# EAGLE schematic APU_PayloadBoard_Schematic (EAGLE 9.7.0)

## Sheet 1 of 2
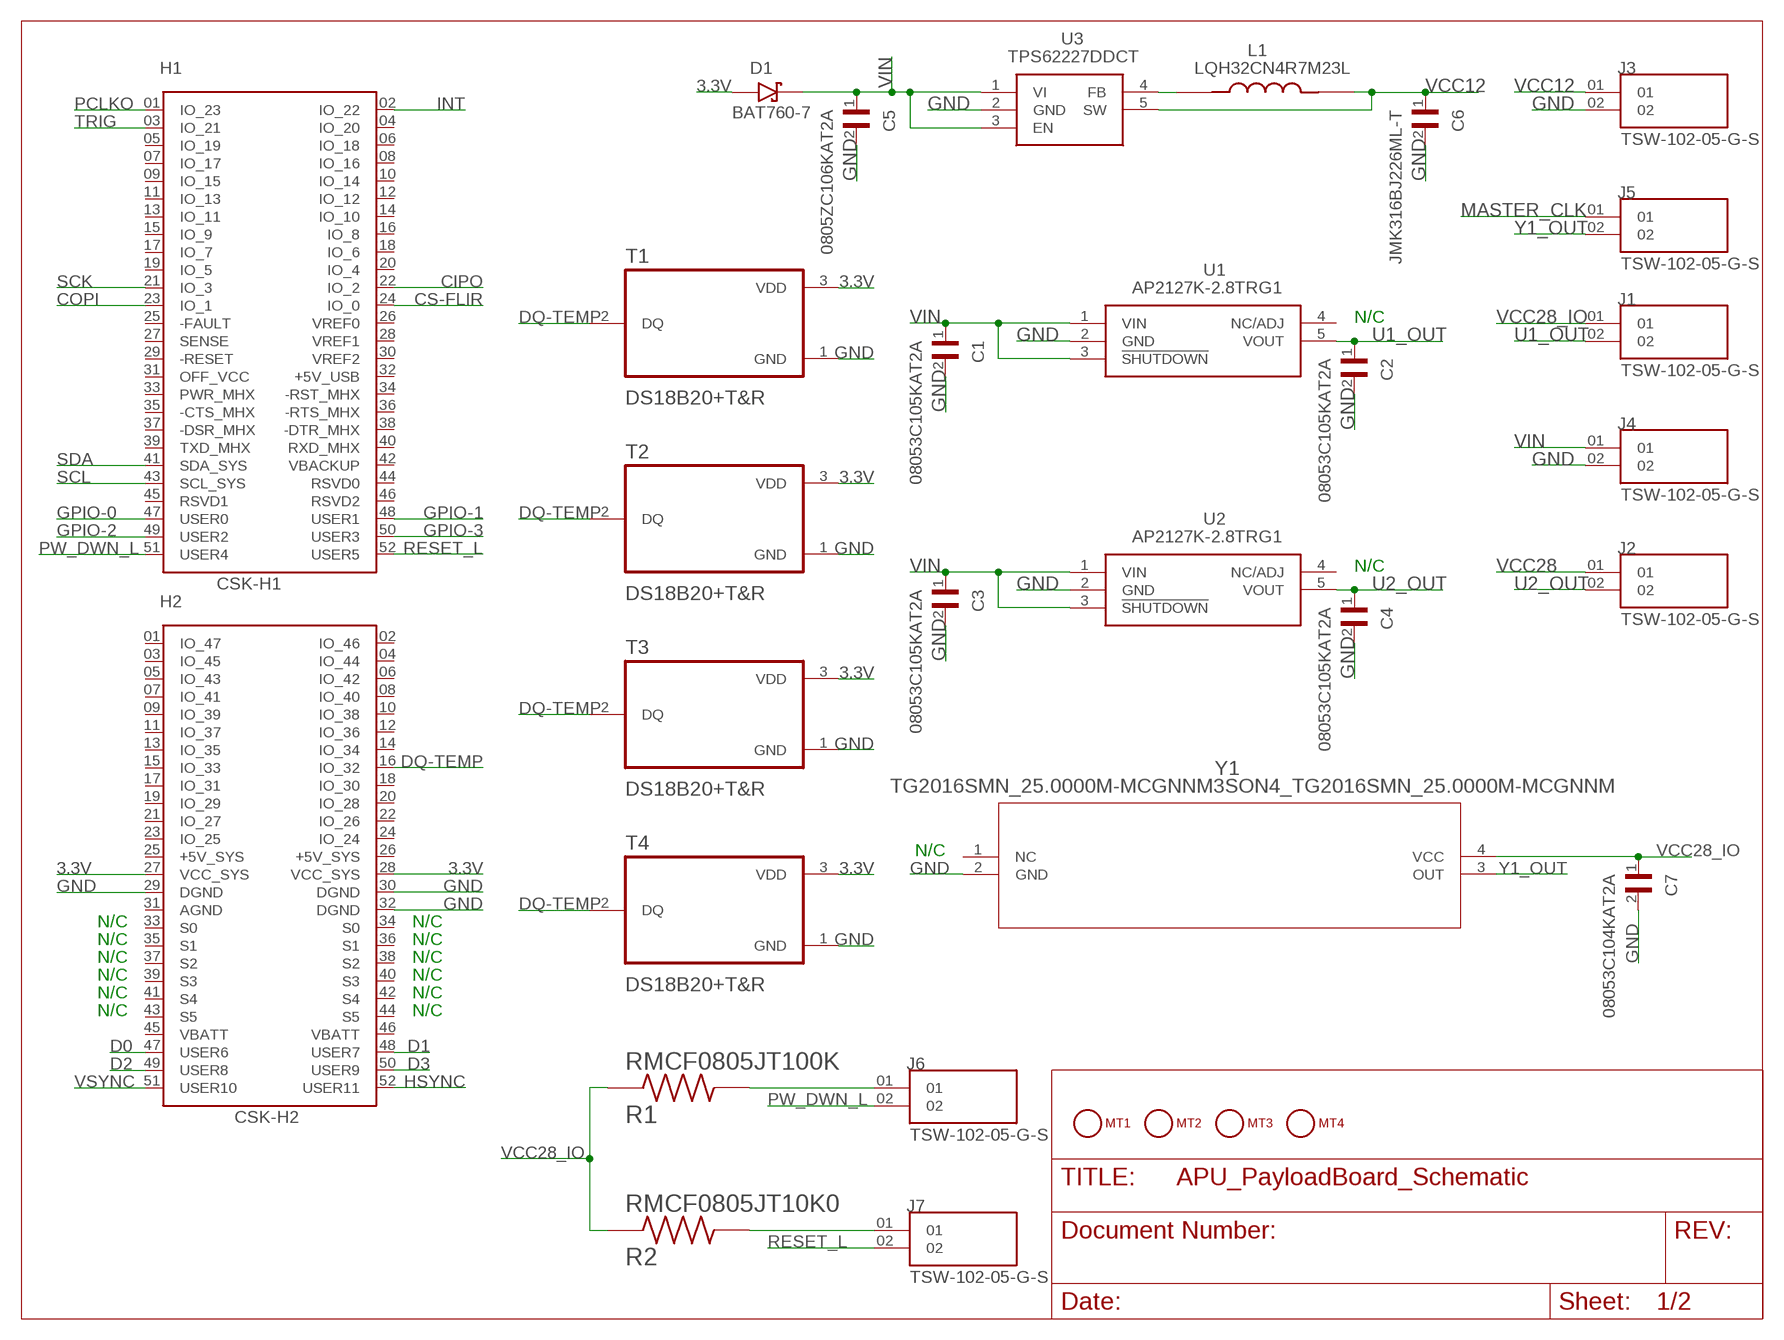
[diagram p0: schematic, sheet 1]

### Parts
C1  08053C105KAT2A  [CAPC2012X94N]
C2  08053C105KAT2A  [CAPC2012X94N]
C3  08053C105KAT2A  [CAPC2012X94N]
C4  08053C105KAT2A  [CAPC2012X94N]
C5  0805ZC106KAT2A  [CAPC2012X152N]
C6  JMK316BJ226ML-T  [CAPC3216X180N]
C7  08053C104KAT2A  [CAPC2012X94N]
D1  BAT760-7  [SOD2513X120N]
H1  CSK-H1  [SAMTEC_ESQ-126-37-G-D--NUMBERED-FOR-CUBESAT-BUS]
H2  CSK-H2  [SAMTEC_ESQ-126-37-G-D--NUMBERED-FOR-CUBESAT-BUS]
J1  TSW-102-05-G-S  [SAMTEC_TSW-102-05-G-S]
J2  TSW-102-05-G-S  [SAMTEC_TSW-102-05-G-S]
J3  TSW-102-05-G-S  [SAMTEC_TSW-102-05-G-S]
J4  TSW-102-05-G-S  [SAMTEC_TSW-102-05-G-S]
J5  TSW-102-05-G-S  [SAMTEC_TSW-102-05-G-S]
J6  TSW-102-05-G-S  [SAMTEC_TSW-102-05-G-S]
J7  TSW-102-05-G-S  [SAMTEC_TSW-102-05-G-S]
L1  LQH32CN4R7M23L  [IND_LQH32CN4R7M23L]
MT1  MOUNTING_HOLE-125_250_ROUND  [MT_125_250]
MT2  MOUNTING_HOLE-125_250_ROUND  [MT_125_250]
MT3  MOUNTING_HOLE-125_250_ROUND  [MT_125_250]
MT4  MOUNTING_HOLE-125_250_ROUND  [MT_125_250]
R1  RMCF0805JT100K  [RESC2012X65N]
R2  RMCF0805JT10K0  [RESC2012X65N]
T1  DS18B20+T&R  [DS18B20+T&R]
T2  DS18B20+T&R  [DS18B20+T&R]
T3  DS18B20+T&R  [DS18B20+T&R]
T4  DS18B20+T&R  [DS18B20+T&R]
U1  AP2127K-2.8TRG1  [SOT95P282X145-5N]
U2  AP2127K-2.8TRG1  [SOT95P282X145-5N]
U3  TPS62227DDCT  [SOT95P280X110-5N]
Y1  TG2016SMN_25.0000M-MCGNNM3SON4_TG2016SMN_25.0000M-MCGNNM  [SON4_TG2016SMN_25.0000M-MCGNNM]

### Nets
3.3V: D1.A H2.27(VCC_SYS) H2.28(VCC_SYS) T1.3(VDD) T2.3(VDD) T3.3(VDD) T4.3(VDD) ; also sheet 2
CIPO: H1.22(IO_2) ; also sheet 2
COPI: H1.23(IO_1) ; also sheet 2
CS-FLIR: H1.24(IO_0) ; also sheet 2
D0: H2.47(USER6) ; also sheet 2
D1: H2.48(USER7) ; also sheet 2
D2: H2.49(USER8) ; also sheet 2
D3: H2.50(USER9) ; also sheet 2
DQ-TEMP: H2.16(IO_32) T1.2(DQ) T2.2(DQ) T3.2(DQ) T4.2(DQ)
GND: C1.2 C2.2 C3.2 C4.2 C5.2 C6.2 C7.2 H2.29(DGND) H2.30(DGND) H2.32(DGND) J3.02 J4.02 T1.1(GND) T2.1(GND) T3.1(GND) T4.1(GND) U1.2(GND) U2.2(GND) U3.2(GND) Y1.2(GND) ; also sheet 2
GPIO-0: H1.47(USER0) ; also sheet 2
GPIO-1: H1.48(USER1) ; also sheet 2
GPIO-2: H1.49(USER2) ; also sheet 2
GPIO-3: H1.50(USER3) ; also sheet 2
HSYNC: H2.52(USER11) ; also sheet 2
INT: H1.02(IO_22) ; also sheet 2
MASTER_CLK: J5.01 ; also sheet 2
N$1: L1.1 U3.4(FB)
N$2: J6.01 R1.2
N$3: J7.01 R2.2
PCLKO: H1.01(IO_23) ; also sheet 2
PW_DWN_L: H1.51(USER4) J6.02 ; also sheet 2
RESET_L: H1.52(USER5) J7.02 ; also sheet 2
SCK: H1.21(IO_3) ; also sheet 2
SCL: H1.43(SCL_SYS) ; also sheet 2
SDA: H1.41(SDA_SYS) ; also sheet 2
TRIG: H1.03(IO_21) ; also sheet 2
U1_OUT: C2.1 J1.02 U1.5(VOUT)
U2_OUT: C4.1 J2.02 U2.5(VOUT)
VCC12: C6.1 J3.01 L1.2 U3.5(SW) ; also sheet 2
VCC28: J2.01 ; also sheet 2
VCC28_IO: C7.1 J1.01 R1.1 R2.1 Y1.4(VCC) ; also sheet 2
VIN: C1.1 C3.1 C5.1 D1.C(K) J4.01 U1.1(VIN) U1.3(!SHUTDOWN) U2.1(VIN) U2.3(!SHUTDOWN) U3.1(VI) U3.3(EN)
VSYNC: H2.51(USER10) ; also sheet 2
Y1_OUT: J5.02 Y1.3(OUT)
Unconnected: H1.04(IO_20) H1.05(IO_19) H1.06(IO_18) H1.07(IO_17) H1.08(IO_16) H1.09(IO_15) H1.10(IO_14) H1.11(IO_13) H1.12(IO_12) H1.13(IO_11) H1.14(IO_10) H1.15(IO_9) H1.16(IO_8) H1.17(IO_7) H1.18(IO_6) H1.19(IO_5) H1.20(IO_4) H1.25(-FAULT) H1.26(VREF0) H1.27(SENSE) H1.28(VREF1) H1.29(-RESET) H1.30(VREF2) H1.31(OFF_VCC) H1.32(+5V_USB) H1.33(PWR_MHX) H1.34(-RST_MHX) H1.35(-CTS_MHX) H1.36(-RTS_MHX) H1.37(-DSR_MHX) H1.38(-DTR_MHX) H1.39(TXD_MHX) H1.40(RXD_MHX) H1.42(VBACKUP) H1.44(RSVD0) H1.45(RSVD1) H1.46(RSVD2) H2.01(IO_47) H2.02(IO_46) H2.03(IO_45) H2.04(IO_44) H2.05(IO_43) H2.06(IO_42) H2.07(IO_41) H2.08(IO_40) H2.09(IO_39) H2.10(IO_38) H2.11(IO_37) H2.12(IO_36) H2.13(IO_35) H2.14(IO_34) H2.15(IO_33) H2.17(IO_31) H2.18(IO_30) H2.19(IO_29) H2.20(IO_28) H2.21(IO_27) H2.22(IO_26) H2.23(IO_25) H2.24(IO_24) H2.25(+5V_SYS) H2.26(+5V_SYS) H2.31(AGND) H2.33(S0) H2.34(S0) H2.35(S1) H2.36(S1) H2.37(S2) H2.38(S2) H2.39(S3) H2.40(S3) H2.41(S4) H2.42(S4) H2.43(S5) H2.44(S5) H2.45(VBATT) H2.46(VBATT) MT1.1 MT2.1 MT3.1 MT4.1 U1.4(NC/ADJ) U2.4(NC/ADJ) Y1.1(NC)

### Notes on the sheet
- N/C
- N/C
- N/C
- N/C | N/C
- N/C | N/C
- N/C | N/C
- N/C | N/C
- N/C | N/C
- N/C | N/C

## Sheet 2 of 2
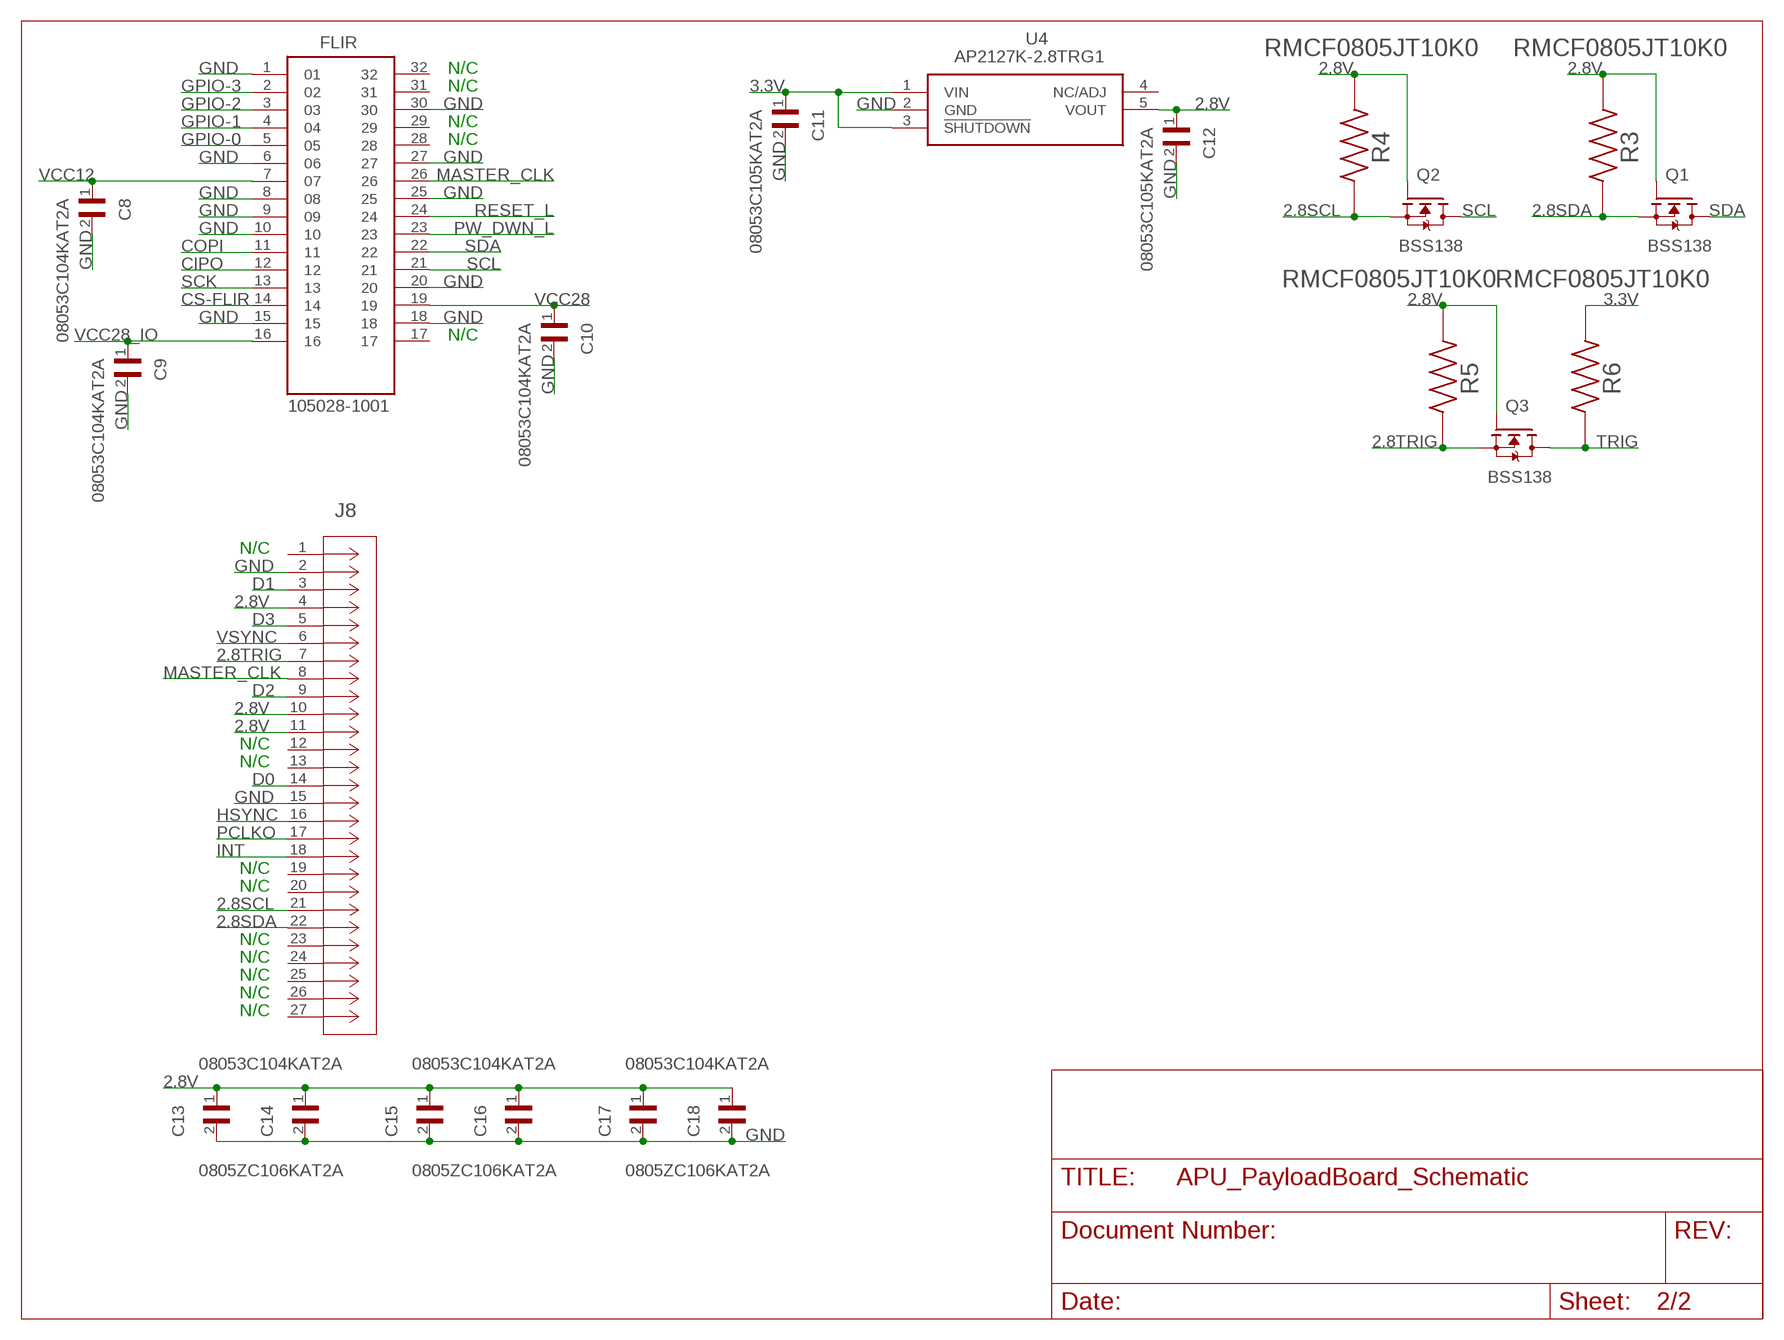
[diagram p1: schematic, sheet 2]

### Parts
C8  08053C104KAT2A  [CAPC2012X94N]
C9  08053C104KAT2A  [CAPC2012X94N]
C10  08053C104KAT2A  [CAPC2012X94N]
C11  08053C105KAT2A  [CAPC2012X94N]
C12  08053C105KAT2A  [CAPC2012X94N]
C13  08053C104KAT2A  [CAPC2012X94N]
C14  0805ZC106KAT2A  [CAPC2012X152N]
C15  08053C104KAT2A  [CAPC2012X94N]
C16  0805ZC106KAT2A  [CAPC2012X152N]
C17  08053C104KAT2A  [CAPC2012X94N]
C18  0805ZC106KAT2A  [CAPC2012X152N]
FLIR  105028-1001  [MOLEX_105028-1001]
J8  SFV25R-1STE1LFCON25_1X25_DR_SFV_JAE  [CON25_1X25_DR_SFV_JAE]
Q1  BSS138  [SOT95P240X111-3N]
Q2  BSS138  [SOT95P240X111-3N]
Q3  BSS138  [SOT95P240X111-3N]
R3  RMCF0805JT10K0  [RESC2012X65N]
R4  RMCF0805JT10K0  [RESC2012X65N]
R5  RMCF0805JT10K0  [RESC2012X65N]
R6  RMCF0805JT10K0  [RESC2012X65N]
U4  AP2127K-2.8TRG1  [SOT95P282X145-5N]

### Nets
2.8SCL: J8.21 Q2.2(S) R4.1
2.8SDA: J8.22 Q1.2(S) R3.1
2.8TRIG: J8.7 Q3.2(S) R5.1
2.8V: C12.1 C13.1 C14.1 C15.1 C16.1 C17.1 C18.1 J8.4 J8.10 J8.11 Q1.1(G) Q2.1(G) Q3.1(G) R3.2 R4.2 R5.2 U4.5(VOUT)
3.3V: C11.1 R6.2 U4.1(VIN) U4.3(!SHUTDOWN) ; also sheet 1
CIPO: FLIR.12 ; also sheet 1
COPI: FLIR.11 ; also sheet 1
CS-FLIR: FLIR.14 ; also sheet 1
D0: J8.14 ; also sheet 1
D1: J8.3 ; also sheet 1
D2: J8.9 ; also sheet 1
D3: J8.5 ; also sheet 1
GND: C8.2 C9.2 C10.2 C11.2 C12.2 C13.2 C14.2 C15.2 C16.2 C17.2 C18.2 FLIR.1 FLIR.6 FLIR.8 FLIR.9 FLIR.10 FLIR.15 FLIR.18 FLIR.20 FLIR.25 FLIR.27 FLIR.30 J8.2 J8.15 U4.2(GND) ; also sheet 1
GPIO-0: FLIR.5 ; also sheet 1
GPIO-1: FLIR.4 ; also sheet 1
GPIO-2: FLIR.3 ; also sheet 1
GPIO-3: FLIR.2 ; also sheet 1
HSYNC: J8.16 ; also sheet 1
INT: J8.18 ; also sheet 1
MASTER_CLK: FLIR.26 J8.8 ; also sheet 1
PCLKO: J8.17 ; also sheet 1
PW_DWN_L: FLIR.23 ; also sheet 1
RESET_L: FLIR.24 ; also sheet 1
SCK: FLIR.13 ; also sheet 1
SCL: FLIR.21 Q2.3(D) ; also sheet 1
SDA: FLIR.22 Q1.3(D) ; also sheet 1
TRIG: Q3.3(D) R6.1 ; also sheet 1
VCC12: C8.1 FLIR.7 ; also sheet 1
VCC28: C10.1 FLIR.19 ; also sheet 1
VCC28_IO: C9.1 FLIR.16 ; also sheet 1
VSYNC: J8.6 ; also sheet 1
Unconnected: FLIR.17 FLIR.28 FLIR.29 FLIR.31 FLIR.32 J8.1 J8.12 J8.13 J8.19 J8.20 J8.23 J8.24 J8.25 J8.26 J8.27 U4.4(NC/ADJ)

### Notes on the sheet
- N/C
- N/C
- N/C
- N/C
- N/C
- N/C
- N/C
- N/C
- N/C
- N/C
- N/C
- N/C
- N/C
- N/C
- N/C

## Library data of the parts
C1-C4 C11 C12 = apu-csk-payloadboard:08053C105KAT2A: Cap Ceramic 1uF 25V X7R 10% SMD 0805 125°C Embossed T/R Check availability <https://pricing.snapeda.com/parts/08053C105KAT2A/AVX/view-part?ref=eda>; AVAILABILITY: In Stock; DESCRIPTION: 1 µF ±10% 25V Ceramic Capacitor X7R 0805 (2012 Metric); MF: AVX; MP: 08053C105KAT2A; PACKAGE: 2012 AVX; PRICE: None; PURCHASE-URL: https://pricing.snapeda.com/search/part/08053C105KAT2A/?ref=eda
C5 C14 C16 C18 = apu-csk-payloadboard:0805ZC106KAT2A: 0805 10 uF 10V ±10% Tolerance X7R SMT Multilayer Ceramic Capacitor Check availability <https://pricing.snapeda.com/parts/0805ZC106KAT2A/AVX/view-part?ref=eda>; AVAILABILITY: In Stock; DESCRIPTION: 10 µF ±10% 10V Ceramic Capacitor X7R 0805 (2012 Metric); MF: AVX; MP: 0805ZC106KAT2A; PACKAGE: 2012 AVX; PRICE: None
C6 = apu-csk-payloadboard:JMK316BJ226ML-T: Cap Ceramic 22uF 6.3V X5R 20% Pad SMD 1206 85C T/R Check availability <https://pricing.snapeda.com/parts/JMK316BJ226ML-T/Taiyo%20Yuden/view-part?ref=eda>; AVAILABILITY: In Stock; DESCRIPTION: 22 µF ±20% 6.3V Ceramic Capacitor X5R 1206 (3216 Metric); MF: Taiyo Yuden; MP: JMK316BJ226ML-T; PACKAGE: 3216 Taiyo Yuden; PRICE: None; PURCHASE-URL: https://pricing.snapeda.com/search?q=JMK316BJ226ML-T&ref=eda
C7-C10 C13 C15 C17 = apu-csk-payloadboard:08053C104KAT2A: Cap Ceramic 0.1uF 25V X7R 10% Pad SMD 0805 125 T/R Check availability <https://pricing.snapeda.com/parts/08053C104KAT2A/AVX/view-part?ref=eda>; AVAILABILITY: In Stock; DESCRIPTION: 0.1 µF ±10% 25V Ceramic Capacitor X7R 0805 (2012 Metric); MF: AVX; MP: 08053C104KAT2A; PACKAGE: 2012 AVX; PRICE: None; PURCHASE-URL: https://pricing.snapeda.com/search/part/08053C104KAT2A/?ref=eda
D1 = apu-csk-payloadboard:BAT760-7: Diode Schottky 30V 1A Surface Mount SOD-323 Check availability <https://pricing.snapeda.com/parts/BAT760-7/Diodes%20Inc./view-part?ref=eda>; AVAILABILITY: In Stock; DESCRIPTION: Diode Schottky 30 V 1A Surface Mount SOD-323; MF: Diodes Inc.; MP: BAT760-7; PACKAGE: SOD-323 Diodes Inc.; PRICE: None; PURCHASE-URL: https://pricing.snapeda.com/search?q=BAT760-7&ref=eda
FLIR = apu-csk-payloadboard:105028-1001: 32 (4 x 8) Pos Camera Socket Socket Gold Surface Mount Check availability <https://pricing.snapeda.com/parts/1050281001/Molex/view-part?ref=eda>; AVAILABILITY: In Stock; DESCRIPTION: 32 (4 x 8) Pos Camera Socket Socket Gold Surface Mount; MF: Molex; MP: 1050281001; PACKAGE: None; PRICE: None; PURCHASE-URL: https://pricing.snapeda.com/search?q=1050281001&ref=eda
H1 = apu-csk-payloadboard:CSK-H1
H2 = apu-csk-payloadboard:CSK-H2
J1-J7 = apu-csk-payloadboard:TSW-102-05-G-S: Check availability <https://pricing.snapeda.com/parts/TSW-102-05-G-S/Samtec%20Inc./view-part?ref=eda>; AVAILABILITY: In Stock; DESCRIPTION: TSW - Samtec 2.54mm Pin Header 8.51mm Overall Pin Length (05) - Fast Stock; MF: Samtec Inc.; MP: TSW-102-05-G-S; PACKAGE: None; PRICE: None; PURCHASE-URL: https://pricing.snapeda.com/search/part/TSW-102-05-G-S/?ref=eda
J8 = apu-csk-payloadboard:SFV25R-1STE1LF; COPYRIGHT: Copyright (C) 2023 Ultra Librarian. All rights reserved.; MANUFACTURER_PART_NUMBER: SFV25R-1STE1LF; MFR_NAME: JAE Electronics
L1 = apu-csk-payloadboard:LQH32CN4R7M23L: Wire Wound Ferrite Inductor for Power Lines For Automotive Check availability <https://pricing.snapeda.com/parts/LQH32CN4R7M23L/Murata%20Electronics/view-part?ref=eda>; AVAILABILITY: In Stock; DESCRIPTION: 4.7µH Unshielded Wirewound Inductor 450mA 260mOhm Max Nonstandard; MF: Murata Electronics; MP: LQH32CN4R7M23L; PACKAGE: NONSTANDARD; PRICE: None; PURCHASE-URL: https://pricing.snapeda.com/search?q=LQH32CN4R7M23L&ref=eda
MT1-MT4 = apu-csk-payloadboard:MOUNTING_HOLE
Q1-Q3 = apu-csk-payloadboard:BSS138: N-Channel 50V 220mA (Ta) 360mW (Ta) Surface Mount SOT-23-3 Check availability <https://pricing.snapeda.com/parts/BSS138/onsemi/view-part?ref=eda>; AVAILABILITY: In Stock; DESCRIPTION: N-Channel 50 V 220mA (Ta) 360mW (Ta) Surface Mount SOT-23-3; MF: onsemi; MP: BSS138; PACKAGE: None; PRICE: None
R1 = apu-csk-payloadboard:RMCF0805JT100K: Check availability <https://pricing.snapeda.com/parts/RMCF0805JT100K/Stackpole%20Electronics%20Inc/view-part?ref=eda>; AVAILABILITY: In Stock; DESCRIPTION: 100 kOhms ±5% 0.125W, 1/8W Chip Resistor 0805 (2012 Metric) Automotive AEC-Q200 Thick Film; MF: Stackpole Electronics Inc; MP: RMCF0805JT100K; PACKAGE: 2012 Stackpole; PRICE: None; PURCHASE-URL: https://pricing.snapeda.com/search?q=RMCF0805JT100K&ref=eda
R2-R6 = apu-csk-payloadboard:RMCF0805JT10K0: Check availability <https://pricing.snapeda.com/parts/RMCF0805JT10K0/Stackpole%20Electronics%20Inc/view-part?ref=eda>; AVAILABILITY: In Stock; DESCRIPTION: 10 kOhms ±5% 0.125W, 1/8W Chip Resistor 0805 (2012 Metric) Automotive AEC-Q200 Thick Film; MF: Stackpole Electronics Inc; MP: RMCF0805JT10K0; PACKAGE: 2012 Stackpole; PRICE: None; PURCHASE-URL: https://pricing.snapeda.com/search/part/RMCF0805JT10K0/?ref=eda
T1-T4 = apu-csk-payloadboard:DS18B20+T&R
U1 U2 U4 = apu-csk-payloadboard:AP2127K-2.8TRG1: LDO Voltage Regulators 300mA Hi Speed LDO 6.5V 450mA Source: Datasheet <https://www.arrow.com/en/products/ap2127k-2.8trg1/diodes-incorporated>; DESCRIPTION: LDO Voltage Regulators 300mA Hi Speed LDO 6.5V 450mA; HEIGHT: 1.45mm; MANUFACTURER_NAME: Diodes Inc.; MANUFACTURER_PART_NUMBER: AP2127K-2.8TRG1; MOUSER_PART_NUMBER: 621-AP2127K-2.8TRG1; MOUSER_PRICE-STOCK: https://www.mouser.co.uk/ProductDetail/Diodes-Incorporated/AP2127K-2.8TRG1?qs=dZoB6MK9LKNOmVxYIQZFIA%3D%3D
U3 = apu-csk-payloadboard:TPS62227DDCT: Texas Instruments, TPS62227DDCT Step-Down Switching Regulator 400mA, 1.2 V, 5-Pin SOT Source: Datasheet <https://www.ti.com/lit/ds/symlink/tps62227.pdf?ts=1618380203511&ref_url=https%3A%2F%2Fwww.ti.com%2Fstore%2Fti%2Fen%2Fp%2Fproduct%2F%3Fp%3DTPS62227DDCT>; DESCRIPTION: Texas Instruments, TPS62227DDCT Step-Down Switching Regulator 400mA, 1.2 V, 5-Pin SOT; HEIGHT: 1.1mm; MANUFACTURER_NAME: Texas Instruments; MANUFACTURER_PART_NUMBER: TPS62227DDCT; MOUSER_PART_NUMBER: 595-TPS62227DDCT; MOUSER_PRICE-STOCK: https://www.mouser.co.uk/ProductDetail/Texas-Instruments/TPS62227DDCT?qs=LVErsypW30zMBlHvllbqLA%3D%3D
Y1 = apu-csk-payloadboard:TG2016SMN_25.0000M-MCGNNM3; COPYRIGHT: Copyright (C) 2023 Ultra Librarian. All rights reserved.; MANUFACTURER_PART_NUMBER: TG2016SMN 25.0000M-MCGNNM3; MFR_NAME: Epson